# Altium schematic sheet Thrusters_V2.0.SchDoc
size A2
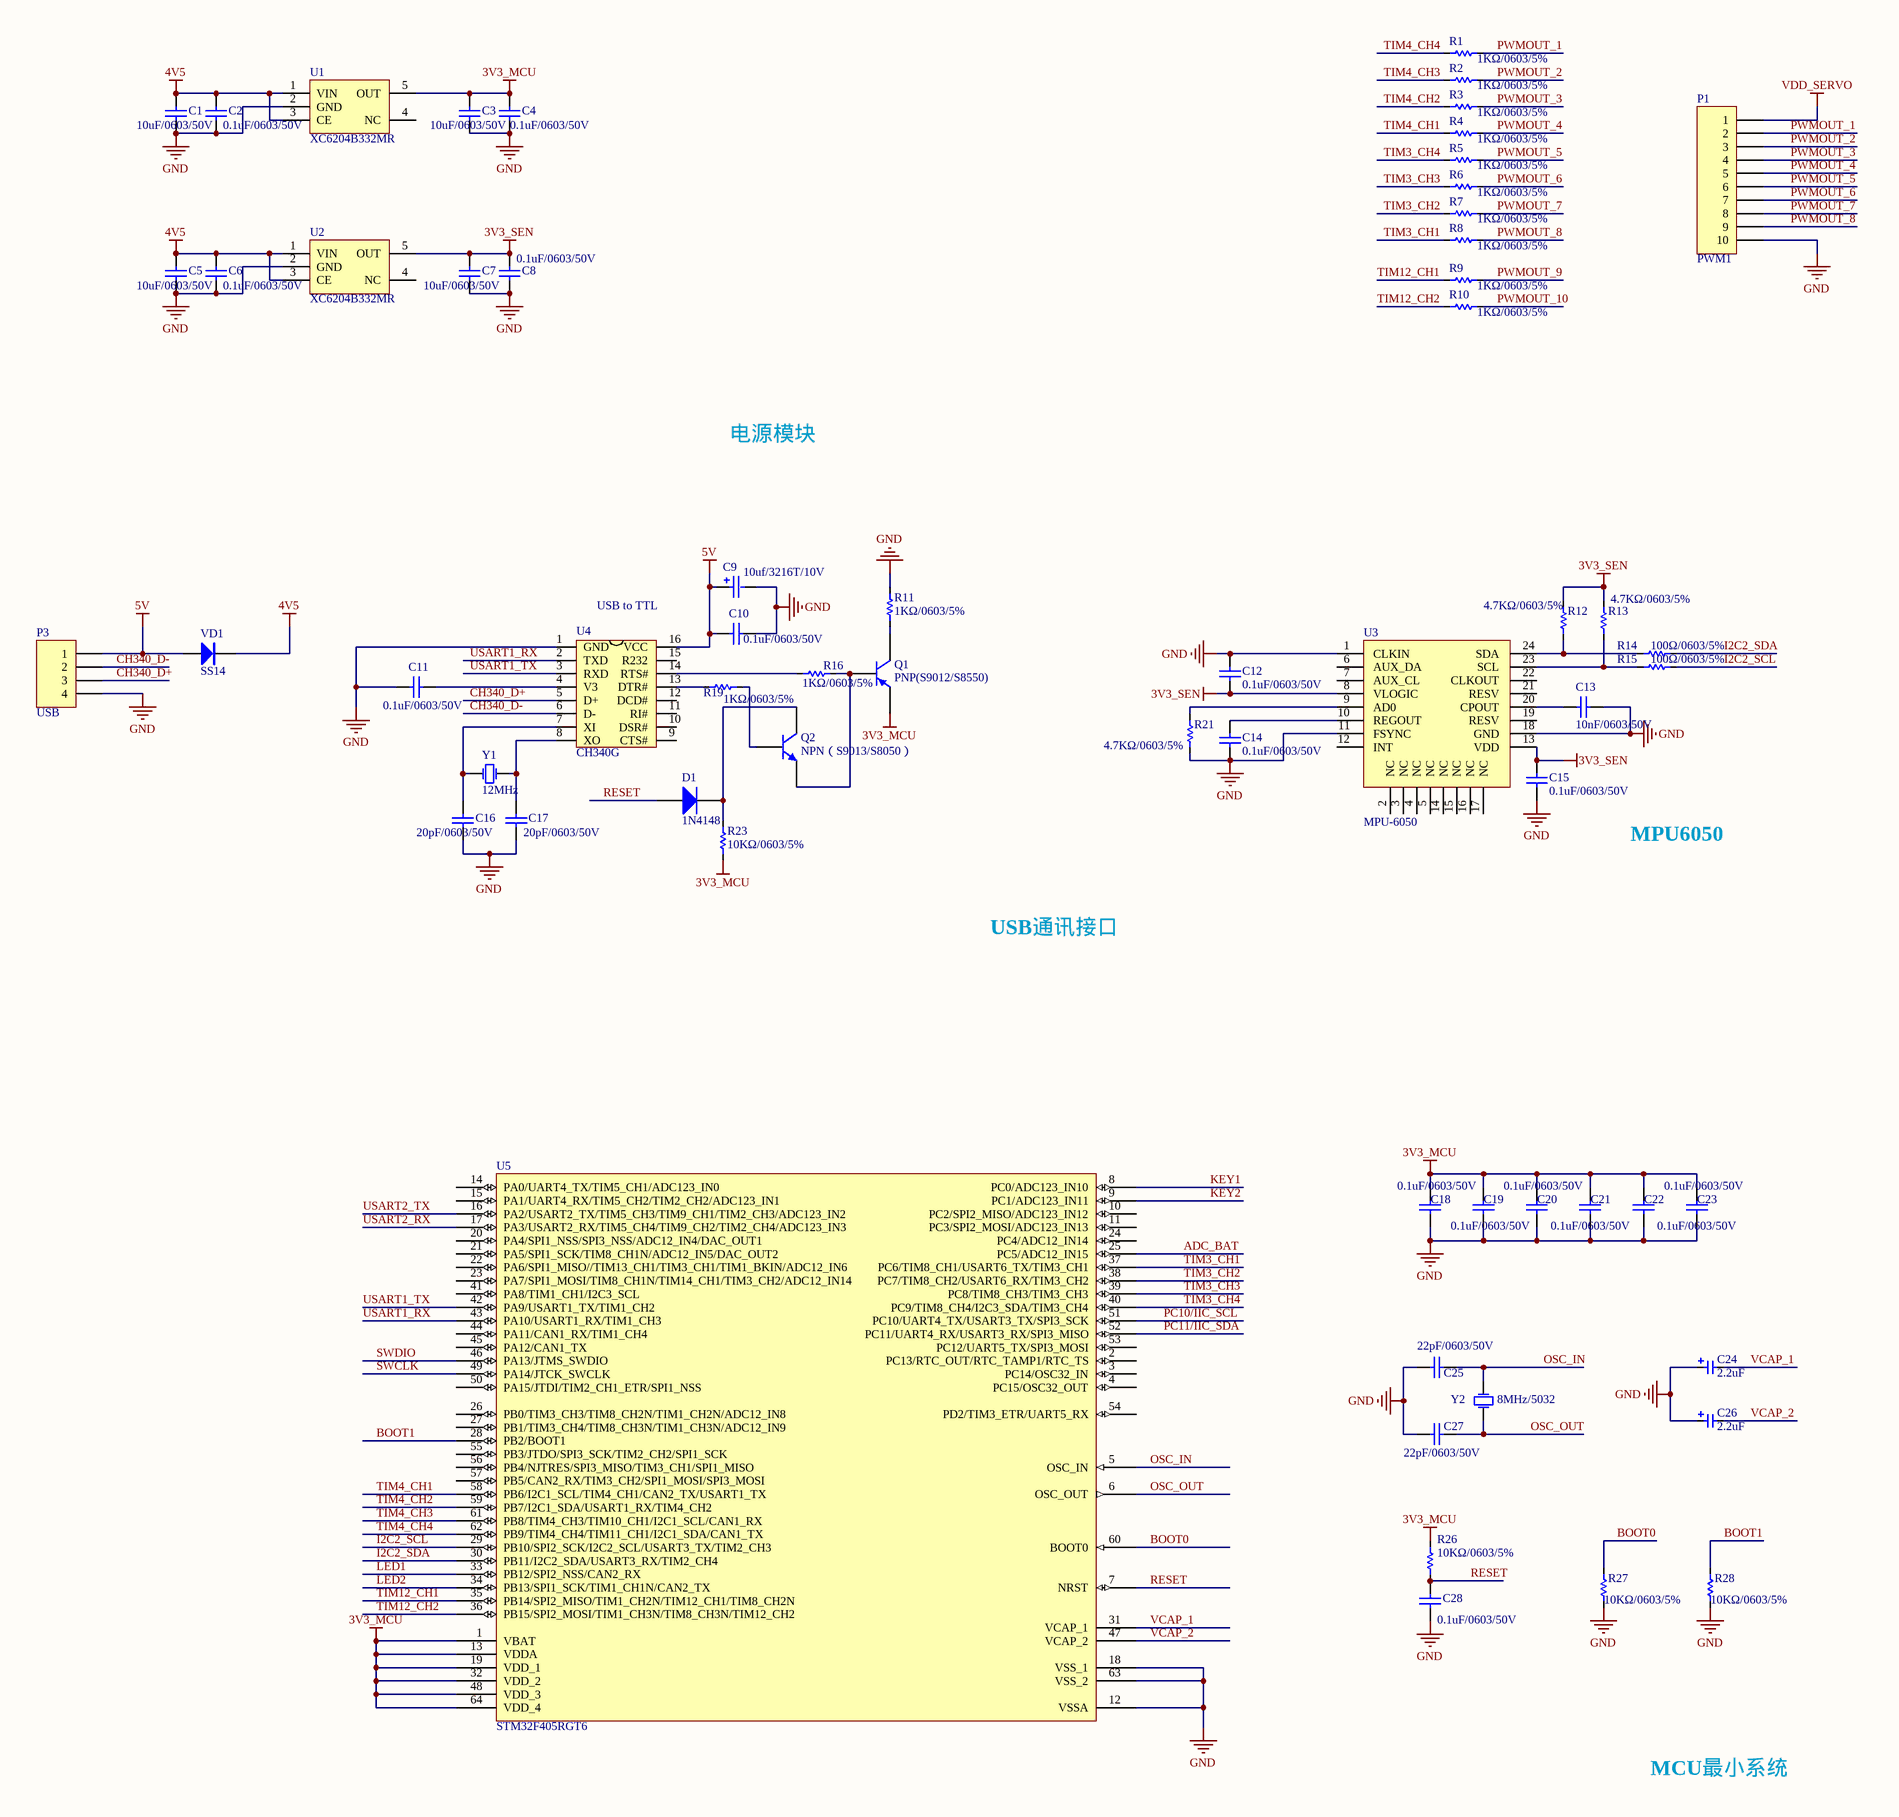
[diagram p0: Thrusters_V2.0.SchDoc, left]
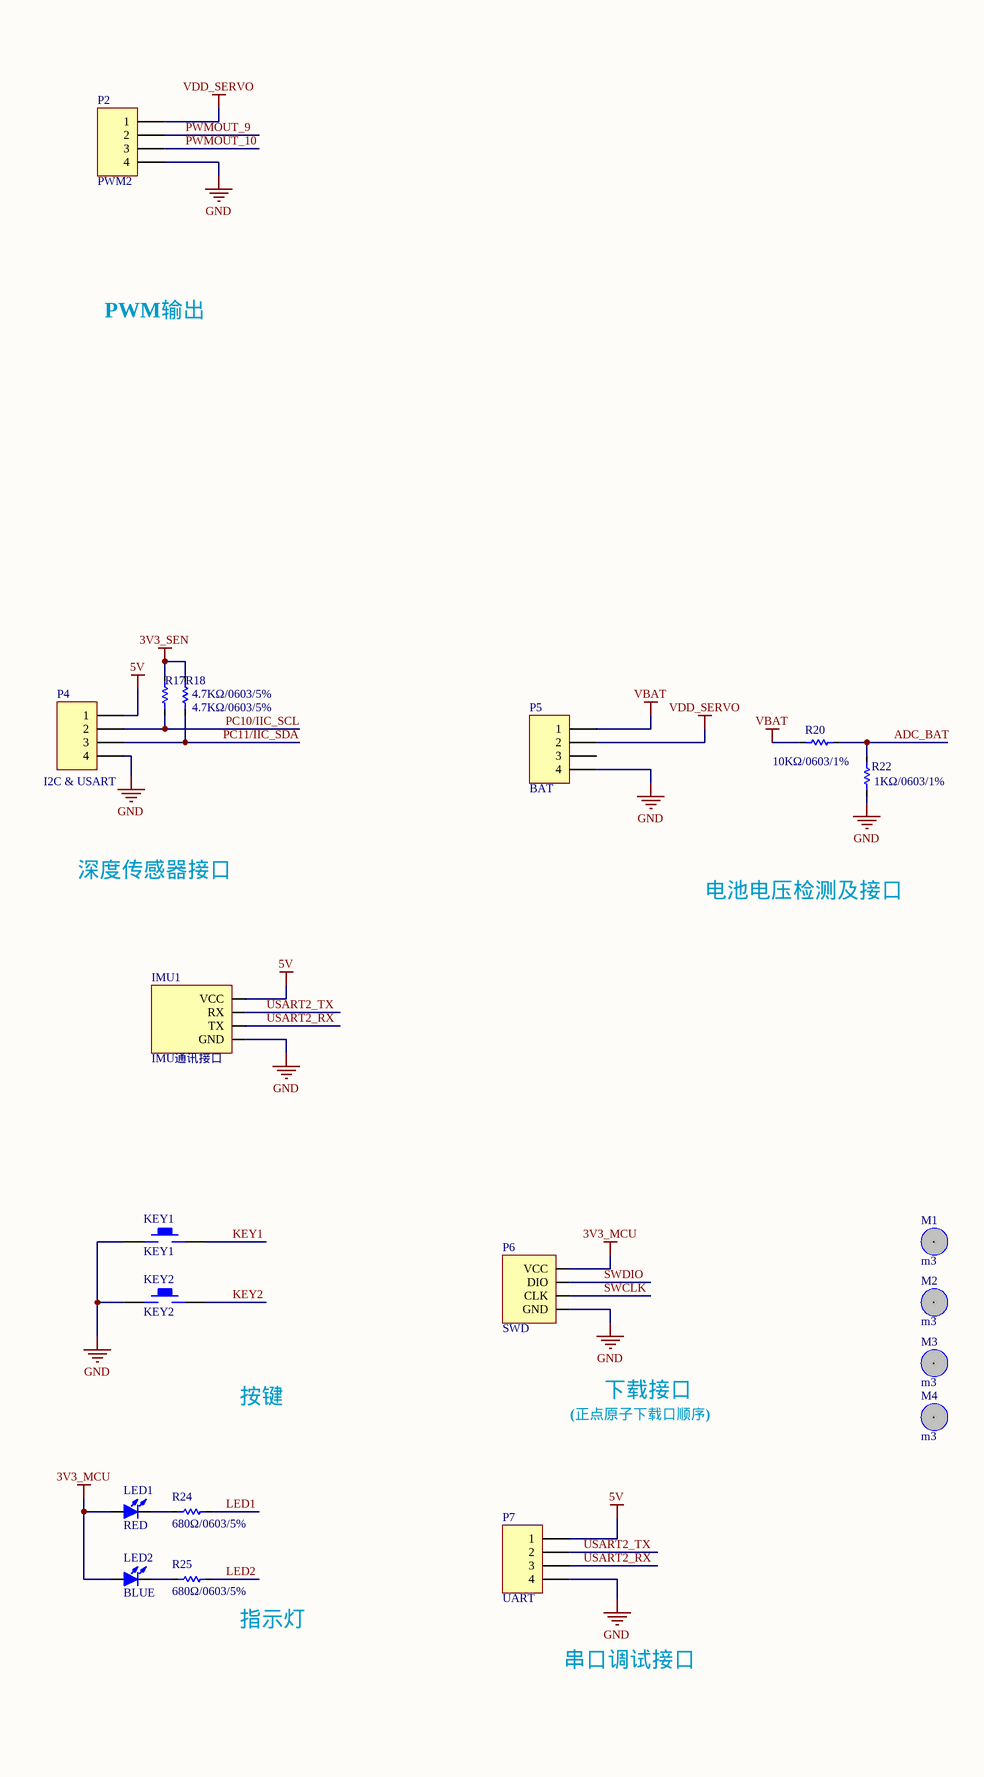
[diagram p1: Thrusters_V2.0.SchDoc, right]

## Parts
C1  10uF/0603/50V  [C0805-JLC]
C2  0.1uF/0603/50V  [C0603-JLC]
C3  10uF/0603/50V  [C0805-JLC]
C4  0.1uF/0603/50V  [C0603-JLC]
C5  10uF/0603/50V  [C0805-JLC]
C6  0.1uF/0603/50V  [C0603-JLC]
C7  10uF/0603/50V  [C0805-JLC]
C8  0.1uF/0603/50V  [C0603-JLC]
C9  10uf/3216T/10V  [Cap Poll 1(3216T)]
C10  0.1uF/0603/50V  [C0603-JLC]
C11  0.1uF/0603/50V  [C0603-JLC]
C12  0.1uF/0603/50V  [C0603-JLC]
C13  10nF/0603/50V  [C0603-JLC]
C14  0.1uF/0603/50V  [C0603-JLC]
C15  0.1uF/0603/50V  [C0603-JLC]
C16  20pF/0603/50V  [C0603-JLC]
C17  20pF/0603/50V  [C0603-JLC]
C18  0.1uF/0603/50V  [C0603-JLC]
C19  0.1uF/0603/50V  [C0603-JLC]
C20  0.1uF/0603/50V  [C0603-JLC]
C21  0.1uF/0603/50V  [C0603-JLC]
C22  0.1uF/0603/50V  [C0603-JLC]
C23  0.1uF/0603/50V  [C0603-JLC]
C24  value 2.2uF  [0603_C]  (hidden comment: Cap_Tan_0805)
C25  22pF/0603/50V  [C0603-JLC]
C26  value 2.2uF  [0603_C]  (hidden comment: Cap_Tan_0805)
C27  22pF/0603/50V  [C0603-JLC]
C28  0.1uF/0603/50V  [C0603-JLC]
D1  1N4148  [SOD-123F]
IMU1  IMU通讯接口  [ATK-IMU901]
KEY1  KEY1  [button-3x4x2mm 2 Pad]
KEY2  KEY2  [button-3x4x2mm 2 Pad]
LED1  RED  [LED0603-RED-JLC]
LED2  BLUE  [LED0603-RED-JLC]
M1  m3  [M3固定孔]
M2  m3  [M3固定孔]
M3  m3  [M3固定孔]
M4  m3  [M3固定孔]
P1  PWM1  [HEADER-GH1.25-10P]
P2  PWM2  [HEADER-GH1.25-4P]
P3  USB  [HEADER-GH1.25-4P]
P4  I2C & USART  [HEADER-GH1.25-4P]
P5  BAT  [HEADER-GH1.25-4P]
P6  SWD  [HEADER-SH1.0-4P-A]
P7  UART  [HEADER-GH1.25-4P]
Q1  PNP(S9012/S8550)  [NPN(S8050/S9103)贴片]
Q2  NPN（S9013/S8050）  [NPN(S8050/S9103)贴片]
R1  1KΩ/0603/5%  [R0603-JLC]
R2  1KΩ/0603/5%  [R0603-JLC]
R3  1KΩ/0603/5%  [R0603-JLC]
R4  1KΩ/0603/5%  [R0603-JLC]
R5  1KΩ/0603/5%  [R0603-JLC]
R6  1KΩ/0603/5%  [R0603-JLC]
R7  1KΩ/0603/5%  [R0603-JLC]
R8  1KΩ/0603/5%  [R0603-JLC]
R9  1KΩ/0603/5%  [R0603-JLC]
R10  1KΩ/0603/5%  [R0603-JLC]
R11  1KΩ/0603/5%  [R0603-JLC]
R12  4.7KΩ/0603/5%  [R0603-JLC]
R13  4.7KΩ/0603/5%  [R0603-JLC]
R14  100Ω/0603/5%  [R0603-JLC]
R15  100Ω/0603/5%  [R0603-JLC]
R16  1KΩ/0603/5%  [R0603-JLC]
R17  4.7KΩ/0603/5%  [R0603-JLC]
R18  4.7KΩ/0603/5%  [R0603-JLC]
R19  1KΩ/0603/5%  [R0603-JLC]
R20  10KΩ/0603/1%  [R0603-JLC]
R21  4.7KΩ/0603/5%  [R0603-JLC]
R22  1KΩ/0603/1%  [R0603-JLC]
R23  10KΩ/0603/5%  [R0603-JLC]
R24  680Ω/0603/5%  [R0603-JLC]
R25  680Ω/0603/5%  [R0603-JLC]
R26  10KΩ/0603/5%  [R0603-JLC]
R27  10KΩ/0603/5%  [R0603-JLC]
R28  10KΩ/0603/5%  [R0603-JLC]
U1  XC6204B332MR  [XC6204B332MR]
U2  XC6204B332MR  [XC6204B332MR]
U3  MPU-6050  [MPU6050-JLC]
U4  CH340G  [SOP16M]
U5  STM32F405RGT6  [STM32_LQFP64]
VD1  SS14  [SOD-123]
Y1  value 12MHz  [XT_5032_2P]  (hidden comment: 12MHz/5032)
Y2  8MHz/5032  [XT_5032_2P]

## Nets
3V3_MCU: C3.2 C4.1 C18.1 C19.1 C20.1 C21.1 C22.1 C23.1 LED1.1(A) LED2.1(A) P6.1(VCC) Q1.E R23.2 R26.2 U1.5(OUT) U5.1(VBAT) U5.13(VDDA) U5.19(VDD_1) U5.32(VDD_2) U5.48(VDD_3) U5.64(VDD_4)
3V3_SEN: C7.2 C8.1 C12.1 C15.2 R12.1 R13.1 R17.1 R18.1 U2.5(OUT) U3.8(VLOGIC) U3.13(VDD)
4V5: C1.2 C2.1 C5.2 C6.1 U1.1(VIN) U1.3(CE) U2.1(VIN) U2.3(CE) VD1.2(K)
5V: C9.1 C10.1 IMU1.2(VCC) P3.1 P4.1 P7.1 U4.16(VCC) VD1.1(A)
GND: C1.1 C2.2 C3.1 C4.2 C5.1 C6.2 C7.1 C8.2 C9.2 C10.2 C11.2 C12.2 C13.1 C14.1 C15.1 C16.1 C17.1 C18.2 C19.2 C20.2 C21.2 C22.2 C23.2 C24.1 C25.1 C26.1 C27.1 C28.2 IMU1.5(GND) KEY1.1 KEY2.1 P1.10 P2.4 P3.4 P4.4 P5.4 P6.4(GND) P7.4 R11.1 R21.2 R22.2 R27.1 R28.1 U1.2(GND) U2.2(GND) U3.1(CLKIN) U3.11(FSYNC) U3.18(GND) U4.1(GND) U5.12(VSSA) U5.18(VSS_1) U5.63(VSS_2)
VBAT: P5.1 R20.1
VDD_SERVO: P1.1 P2.1 P5.2
ADC_BAT: R20.2 R22.1 U5.25(PC5/ADC12_IN15)
BOOT0: R27.2 U5.60(BOOT0)
BOOT1: R28.2 U5.28(PB2/BOOT1)
CH340_D+: P3.3 U4.5(D+)
CH340_D-: P3.2 U4.6(D-)
I2C2_SCL: R15.2 U5.29(PB10/SPI2_SCK/I2C2_SCL/USART3_TX/TIM2_CH3)
I2C2_SDA: R14.2 U5.30(PB11/I2C2_SDA/USART3_RX/TIM2_CH4)
KEY1: KEY1.2 U5.8(PC0/ADC123_IN10)
KEY2: KEY2.2 U5.9(PC1/ADC123_IN11)
LED1: R24.1 U5.33(PB12/SPI2_NSS/CAN2_RX)
LED2: R25.1 U5.34(PB13/SPI1_SCK/TIM1_CH1N/CAN2_TX)
OSC_IN: C25.2 U5.5(OSC_IN) Y2.2(OSC2)
OSC_OUT: C27.2 U5.6(OSC_OUT) Y2.1(OSC1)
PC10/IIC_SCL: P4.2 R17.2 U5.51(PC10/UART4_TX/USART3_TX/SPI3_SCK)
PC11/IIC_SDA: P4.3 R18.2 U5.52(PC11/UART4_RX/USART3_RX/SPI3_MISO)
PWMOUT_1: P1.2 R1.1
PWMOUT_2: P1.3 R2.1
PWMOUT_3: P1.4 R3.1
PWMOUT_4: P1.5 R4.1
PWMOUT_5: P1.6 R5.1
PWMOUT_6: P1.7 R6.1
PWMOUT_7: P1.8 R7.1
PWMOUT_8: P1.9 R8.1
PWMOUT_9: P2.2 R9.1
PWMOUT_10: P2.3 R10.1
RESET: C28.1 D1.1(A) R26.1 U5.7(NRST)
SWCLK: P6.3(CLK) U5.49(PA14/JTCK_SWCLK)
SWDIO: P6.2(DIO) U5.46(PA13/JTMS_SWDIO)
TIM3_CH1: R8.2 U5.37(PC6/TIM8_CH1/USART6_TX/TIM3_CH1)
TIM3_CH2: R7.2 U5.38(PC7/TIM8_CH2/USART6_RX/TIM3_CH2)
TIM3_CH3: R6.2 U5.39(PC8/TIM8_CH3/TIM3_CH3)
TIM3_CH4: R5.2 U5.40(PC9/TIM8_CH4/I2C3_SDA/TIM3_CH4)
TIM4_CH1: R4.2 U5.58(PB6/I2C1_SCL/TIM4_CH1/CAN2_TX/USART1_TX)
TIM4_CH2: R3.2 U5.59(PB7/I2C1_SDA/USART1_RX/TIM4_CH2)
TIM4_CH3: R2.2 U5.61(PB8/TIM4_CH3/TIM10_CH1/I2C1_SCL/CAN1_RX)
TIM4_CH4: R1.2 U5.62(PB9/TIM4_CH4/TIM11_CH1/I2C1_SDA/CAN1_TX)
TIM12_CH1: R9.2 U5.35(PB14/SPI2_MISO/TIM1_CH2N/TIM12_CH1/TIM8_CH2N)
TIM12_CH2: R10.2 U5.36(PB15/SPI2_MOSI/TIM1_CH3N/TIM8_CH3N/TIM12_CH2)
USART1_RX: U4.2(TXD) U5.43(PA10/USART1_RX/TIM1_CH3)
USART1_TX: U4.3(RXD) U5.42(PA9/USART1_TX/TIM1_CH2)
USART2_RX: IMU1.4(TX) P7.3 U5.17(PA3/USART2_RX/TIM5_CH4/TIM9_CH2/TIM2_CH4/ADC123_IN3)
USART2_TX: IMU1.3(RX) P7.2 U5.16(PA2/USART2_TX/TIM5_CH3/TIM9_CH1/TIM2_CH3/ADC123_IN2)
VCAP_1: C24.2 U5.31(VCAP_1)
VCAP_2: C26.2 U5.47(VCAP_2)
NetC11_1: C11.1 U4.4(V3)
NetC13_2: C13.2 U3.20(CPOUT)
NetC14_2: C14.2 U3.10(REGOUT)
NetC16_2: C16.2 U4.7(XI) Y1.2(OSC2)
NetC17_2: C17.2 U4.8(XO) Y1.1(OSC1)
NetD1_2: D1.2(K) Q2.C R23.1
NetLED1_2: LED1.2(K) R24.2
NetLED2_2: LED2.2(K) R25.2
NetQ1_B: Q1.B Q2.E R16.1
NetQ1_C: Q1.C R11.2
NetQ2_B: Q2.B R19.1
NetR12_2: R12.2 R14.1 U3.24(SDA)
NetR13_2: R13.2 R15.1 U3.23(SCL)
NetR16_2: R16.2 U4.14(RTS#)
NetR19_2: R19.2 U4.13(DTR#)
NetR21_1: R21.1 U3.9(AD0)

Not connected (* = marked no-connect by the designer): M1 1(m); M2 1(m); M3 1(m); M4 1(m); P5 3; U1 4(NC); U2 4(NC); U3 2(NC) 3(NC) 4(NC) 5(NC) 6(AUX_DA) 7(AUX_CL) 12(INT) 14(NC) 15(NC) 16(NC) 17(NC) 19(RESV) 21(RESV) 22(CLKOUT); U4 9(CTS#) 10(DSR#) 11(RI#) 12(DCD#) 15(R232); U5 2(PC13/RTC_OUT/RTC_TAMP1/RTC_TS) 3(PC14/OSC32_IN) 4(PC15/OSC32_OUT) 10(PC2/SPI2_MISO/ADC123_IN12) 11(PC3/SPI2_MOSI/ADC123_IN13) 14(PA0/UART4_TX/TIM5_CH1/ADC123_IN0) 15(PA1/UART4_RX/TIM5_CH2/TIM2_CH2/ADC123_IN1) 20(PA4/SPI1_NSS/SPI3_NSS/ADC12_IN4/DAC_OUT1) 21(PA5/SPI1_SCK/TIM8_CH1N/ADC12_IN5/DAC_OUT2) 22(PA6/SPI1_MISO//TIM13_CH1/TIM3_CH1/TIM1_BKIN/ADC12_IN6) 23(PA7/SPI1_MOSI/TIM8_CH1N/TIM14_CH1/TIM3_CH2/ADC12_IN14) 24(PC4/ADC12_IN14) 26(PB0/TIM3_CH3/TIM8_CH2N/TIM1_CH2N/ADC12_IN8) 27(PB1/TIM3_CH4/TIM8_CH3N/TIM1_CH3N/ADC12_IN9) 41(PA8/TIM1_CH1/I2C3_SCL) 44(PA11/CAN1_RX/TIM1_CH4) 45(PA12/CAN1_TX) 50(PA15/JTDI/TIM2_CH1_ETR/SPI1_NSS) 53(PC12/UART5_TX/SPI3_MOSI) 54(PD2/TIM3_ETR/UART5_RX) 55(PB3/JTDO/SPI3_SCK/TIM2_CH2/SPI1_SCK) 56(PB4/NJTRES/SPI3_MISO/TIM3_CH1/SPI1_MISO) 57(PB5/CAN2_RX/TIM3_CH2/SPI1_MOSI/SPI3_MOSI)

## Notes on the sheet
- PWM输出
- 电源模块
- (near U4) USB to TTL
- MPU6050
- USB通讯接口
- 深度传感器接口
- 电池电压检测及接口
- 按键
- 下载接口
- (正点原子下载口顺序)
- (near R25) 指示灯
- 串口调试接口
- MCU最小系统

## Library data of the parts
C1-C8 C10-C23 C25 C27 C28 = CAP_0805/0603/0402: CAP 0805 0603 0402; Value: 22pF
C9 = Cap Poll: Polarized Capacitor (Surface Mount)(钽电容); value: 10uF
C24 C26 = Cap_Tan_0805: Polarized Capacitor (Surface Mount)(钽电容)
D1 = D
IMU1 = ATK-IMU901: 正点原子ATK-IMU901模块接口
KEY1 KEY2 = KEY: 按键
LED1 LED2 = LED-SMD: 贴片LED; 版权归属: 源创客; BOM名称: 贴片LED; 学习资源: www.ooocke.com
M1-M4 = M3固定孔
P1 = HEADER10: Header, 8-Pin
P2-P5 P7 = HEADER4: Header, 4-Pin
P6 = SWD-下载接口: SWD调试下载接口
Q1 = PNP(S9012/S8550): PNP Bipolar Transistor
Q2 = NPN(S9103/S8050): NPN Bipolar Transistor
R1-R23 R26-R28 = Res: Resistor; precision: 1%; power: 1/16W; Value: 1K
R24 R25 = Res: Resistor; Value: 1K; precision: 1%; power: 1/16W
U1 U2 = LDO XC6204: LDO; BOM名称: 稳压芯片; 版权归属: 源创客; 学习资源: www.ooocke.com
U4 = CH340G: USB2UART
U5 = STM32F405RGT6: STM32 ARM-based 32-bit MCU with 1024 Kbytes of Flash memory, 64-pin LQFP, Industrial Temperature
VD1 = SS14: 肖特基二极管; 版权归属: 源创客; 属性: 40V/1A; BOM名称: 肖特基二极管; 学习资源: www.ooocke.com
Y1 = XTAL: Crystal Oscillator; Value: 32.768KHz
Y2 = XTAL: Crystal Oscillator; Value: 32.768KHz; Value: 8MHz